# Altium schematic sheet connector.SchDoc
size A
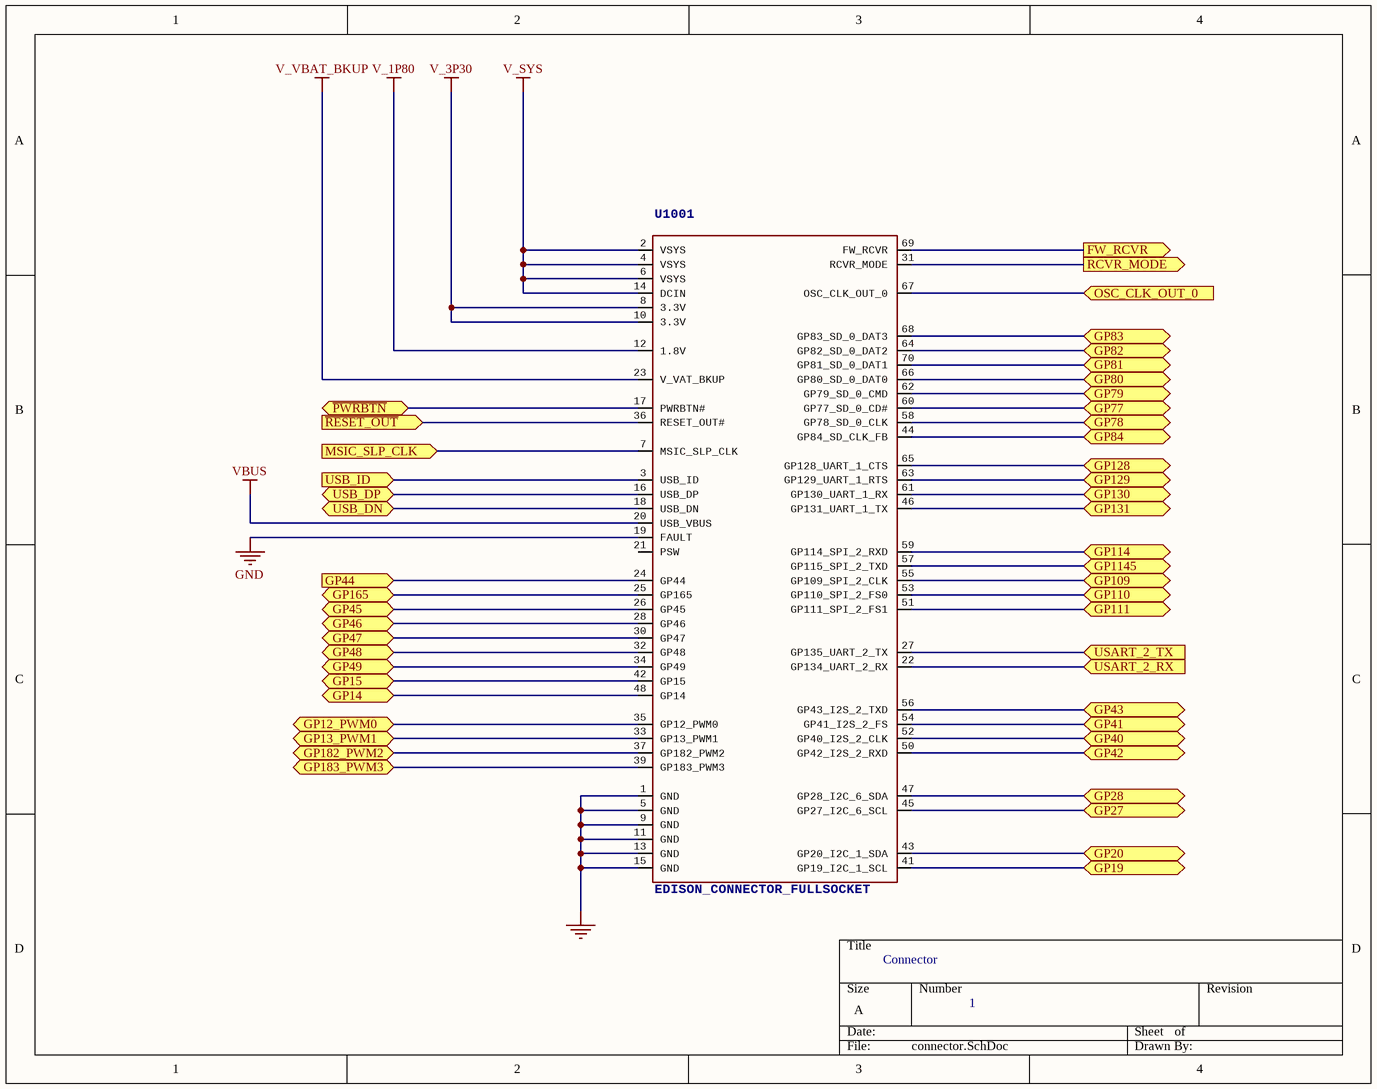
[diagram p0: connector.SchDoc]

## Parts
U1001  EDISON_CONNECTOR_FULLSOCKET  [EDISON_DAUGHTER_TOP]

## Ports
FW_RCVR (out), GP12_PWM0 (bidir), GP13_PWM1 (bidir), GP14 (bidir), GP15 (bidir), GP19 (bidir), GP20 (bidir), GP27 (bidir), GP28 (bidir), GP40 (bidir), GP41 (bidir), GP42 (bidir), GP43 (bidir), GP44 (in), GP45 (bidir), GP46 (bidir), GP47 (bidir), GP48 (bidir), GP49 (bidir), GP77 (bidir), GP78 (bidir), GP79 (bidir), GP80 (bidir), GP81 (bidir), GP82 (bidir), GP83 (bidir), GP84 (bidir), GP109 (bidir), GP110 (bidir), GP111 (bidir), GP114 (bidir), GP128 (bidir), GP129 (bidir), GP130 (bidir), GP131 (bidir), GP165 (bidir), GP182_PWM2 (bidir), GP183_PWM3 (bidir), GP1145 (bidir), MSIC_SLP_CLK (in), OSC_CLK_OUT_0 (in), RCVR_MODE (out), USART_2_RX (in), USART_2_TX (in), USB_DN (bidir), USB_DP (bidir), USB_ID (in), ~{PWRBTN} (bidir), ~{RESET_OUT} (in)

## Nets
GND: U1001.1(GND) U1001.5(GND) U1001.9(GND) U1001.11(GND) U1001.13(GND) U1001.15(GND) U1001.19(FAULT)
V_1P80: U1001.12(1.8V)
V_3P30: U1001.8(3.3V) U1001.10(3.3V)
V_SYS: U1001.2(VSYS) U1001.4(VSYS) U1001.6(VSYS) U1001.14(DCIN)
V_VBAT_BKUP: U1001.23(V_VAT_BKUP)
VBUS: U1001.20(USB_VBUS)
FW_RCVR: U1001.69(FW_RCVR) ; port FW_RCVR
GP12_PWM0: U1001.35(GP12_PWM0) ; port GP12_PWM0
GP13_PWM1: U1001.33(GP13_PWM1) ; port GP13_PWM1
GP14: U1001.48(GP14) ; port GP14
GP15: U1001.42(GP15) ; port GP15
GP19: U1001.41(GP19_I2C_1_SCL) ; port GP19
GP20: U1001.43(GP20_I2C_1_SDA) ; port GP20
GP27: U1001.45(GP27_I2C_6_SCL) ; port GP27
GP28: U1001.47(GP28_I2C_6_SDA) ; port GP28
GP40: U1001.52(GP40_I2S_2_CLK) ; port GP40
GP41: U1001.54(GP41_I2S_2_FS) ; port GP41
GP42: U1001.50(GP42_I2S_2_RXD) ; port GP42
GP43: U1001.56(GP43_I2S_2_TXD) ; port GP43
GP44: U1001.24(GP44) ; port GP44
GP45: U1001.26(GP45) ; port GP45
GP46: U1001.28(GP46) ; port GP46
GP47: U1001.30(GP47) ; port GP47
GP48: U1001.32(GP48) ; port GP48
GP49: U1001.34(GP49) ; port GP49
GP77: U1001.60(GP77_SD_0_CD#) ; port GP77
GP78: U1001.58(GP78_SD_0_CLK) ; port GP78
GP79: U1001.62(GP79_SD_0_CMD) ; port GP79
GP80: U1001.66(GP80_SD_0_DAT0) ; port GP80
GP81: U1001.70(GP81_SD_0_DAT1) ; port GP81
GP82: U1001.64(GP82_SD_0_DAT2) ; port GP82
GP83: U1001.68(GP83_SD_0_DAT3) ; port GP83
GP84: U1001.44(GP84_SD_CLK_FB) ; port GP84
GP109: U1001.55(GP109_SPI_2_CLK) ; port GP109
GP110: U1001.53(GP110_SPI_2_FS0) ; port GP110
GP111: U1001.51(GP111_SPI_2_FS1) ; port GP111
GP114: U1001.59(GP114_SPI_2_RXD) ; port GP114
GP128: U1001.65(GP128_UART_1_CTS) ; port GP128
GP129: U1001.63(GP129_UART_1_RTS) ; port GP129
GP130: U1001.61(GP130_UART_1_RX) ; port GP130
GP131: U1001.46(GP131_UART_1_TX) ; port GP131
GP165: U1001.25(GP165) ; port GP165
GP182_PWM2: U1001.37(GP182_PWM2) ; port GP182_PWM2
GP183_PWM3: U1001.39(GP183_PWM3) ; port GP183_PWM3
GP1145: U1001.57(GP115_SPI_2_TXD) ; port GP1145
MSIC_SLP_CLK: U1001.7(MSIC_SLP_CLK) ; port MSIC_SLP_CLK
OSC_CLK_OUT_0: U1001.67(OSC_CLK_OUT_0) ; port OSC_CLK_OUT_0
~{PWRBTN}: U1001.17(PWRBTN#) ; port ~{PWRBTN}
~{RESET_OUT}: U1001.36(RESET_OUT#) ; port ~{RESET_OUT}
RCVR_MODE: U1001.31(RCVR_MODE) ; port RCVR_MODE
USART_2_RX: U1001.22(GP134_UART_2_RX) ; port USART_2_RX
USART_2_TX: U1001.27(GP135_UART_2_TX) ; port USART_2_TX
USB_DN: U1001.18(USB_DN) ; port USB_DN
USB_DP: U1001.16(USB_DP) ; port USB_DP
USB_ID: U1001.3(USB_ID) ; port USB_ID

Not connected (* = marked no-connect by the designer): U1001 21(PSW)

## Notes on the sheet
- Connector
- 1

## Library data of the parts
U1001 = EDISON_CONNECTOR_FULLSOCKET: Supplier 1: Digi-Key; Supplier Part Number 1: H11630CT-ND